# Altium schematic sheet UCC 28180-1-V02.SchDoc: Title is Here
size B; Author: Taisen Zhuang; Organization: Altium Limited; Address1: L3, 12a Rodborough Rd; Address2: Frenchs Forest; Address3: NSW; Address4: Australia 2086; DocumentNumber: FMC_Microzed; Revision: B; SheetNumber: 1; SheetTotal: 3
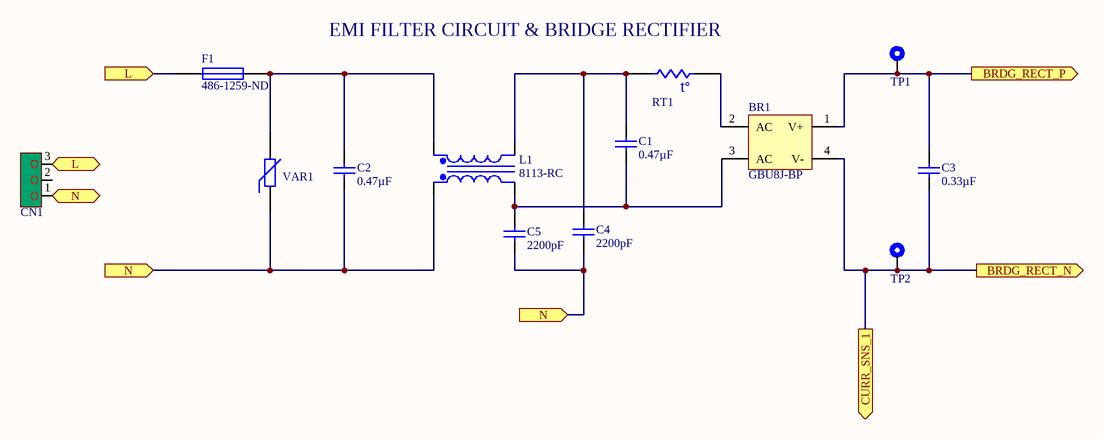
[diagram p0: UCC 28180-1-V02.SchDoc]

## Parts
BR1  GBU8J-BP  [GBU8J]
C1  Capacitance: 0.47µF  [ECQ-U2A474ML]  (hidden comment: ECQ-U2A474ML)
C2  Capacitance: 0.47µF  [ECQ-U2A474ML]  (hidden comment: ECQ-U2A474ML)
C3  Capacitance: 0.33µF  [CAPFILM0.33U]  (hidden comment: ECQ-U2A334ML)
C4  Capacitance: 2200pF  [CS11-E2GA222MYNS]  (hidden comment: CS11-E2GA222MYNS)
C5  Capacitance: 2200pF  [CS11-E2GA222MYNS]  (hidden comment: CS11-E2GA222MYNS)
CN1  1935789  [CONN_1935789]  (value not drawn)
F1  Supplier Part Number 1: 486-1259-ND  [0031.8211]  (hidden comment: FUSE)
L1  8113-RC  [EMI Choke]
RT1  CL-40  [CL-40]  (value not drawn)
TP1  5006  [Test Point]  (value not drawn)
TP2  5006  [Test Point]  (value not drawn)
VAR1  S10K275E2  [S10K275E2]  (value not drawn)

## Ports
BRDG_RECT_N (out), BRDG_RECT_P (out), CURR_SNS_1 (out), L (in), L (out), N (in), N (out)

## Nets
BRDG_RECT_N: BR1.4(V-) C3.1 TP2.1 ; port BRDG_RECT_N, port CURR_SNS_1
BRDG_RECT_P: BR1.1(V+) C3.2 TP1.1 ; port BRDG_RECT_P
L: CN1.3 F1.1 ; port L
N: C2.2 C4.1 C5.1 CN1.1 L1.1(Pri+) VAR1.1 ; port N
NetBR1_2: BR1.2(AC) RT1.1
NetBR1_3: BR1.3(AC) C1.1 C5.2 L1.2(Pri-)
NetC1_2: C1.2 C4.2 L1.3(Sec-) RT1.2
NetC2_1: C2.1 F1.2 L1.4(Sec+) VAR1.2

Not connected (* = marked no-connect by the designer): CN1 2

## Notes on the sheet
- (near RT1) EMI FILTER CIRCUIT & BRIDGE RECTIFIER
- PMLS Engineers R&D
- Title:
- Size:
- Date:
- B
- Document Number:
- Sheet:
- of
- Author:
- Rev:
- (in symbol CL-40) t°

## Library data of the parts
BR1 = GBU8J-BP: RECT BRIDGE GPP 8A 600V GBU; Manufacturer 1: Micro Commercial Co; Category 1: Discrete Semiconductor Products; Diode Type: Single Phase; Supplier 1: Digi-Key; Supplier Part Number 1: GBU8J-BPMS-ND; RoHS 1: RoHS Compliant; Description 1: RECT BRIDGE GPP 8A 600V GBU; Stock 1: 5723; Pricing 1: 1=0.98, 10=0.868, 25=0.784, 100=0.686, 250=0.602, 500=0.532, 1000=0.42, 2500=0.392, 5000=0.3724 (USD); Packaging: Tube; Part Status: Active; Voltage - Peak Reverse (Max): 600V; Current - DC Forward (If) (Max): 8A; Mounting Type: Through Hole; Package / Case: 4-SIP, GBU; Operating Temperature: -55°C ~ 150°C (TJ); Supplier Device Package: GBU; ComponentLink1URL: http://www.mccsemi.com/up_pdf/GBU8A-GBU8M(GBU).pdf; ComponentLink1Description: http://www.mccsemi.com/up_pdf/GBU8A-GBU8M(GBU).pdf; Manufacturer Part Number 1: GBU8J-BP
C1 C2 = ECQ-U2A474ML: CAP FILM 0.47UF 20% 275VAC RAD; Manufacturer 1: Panasonic Electronic Components; Category 1: Capacitors; Voltage Rating - AC: 275V; Dielectric Material: Polyester, Metallized; Supplier 1: Digi-Key; Supplier Part Number 1: P10734-ND; Manufacturer Part Number 1: ECQ-U2A474ML; RoHS 1: RoHS Compliant; Description 1: CAP FILM 0.47UF 20% 275VAC RAD; Stock 1: 12592; Pricing 1: 1=0.63, 10=0.464, 25=0.3976, 50=0.371, 100=0.318, 250=0.29152, 500=0.25176, 1000=0.212, 5000=0.1855 (USD); Packaging: Bulk; Part Status: Active; Tolerance: ±20%; Voltage Rating - DC: -; ESR (Equivalent Series Resistance): -; Operating Temperature: -40°C ~ 100°C; Mounting Type: Through Hole; Package / Case: Radial; Size / Dimension: 1.004" L x 0.335" W (25.50mm x 8.50mm); Height - Seated (Max): 0.709" (18.00mm); Termination: PC Pins; Lead Spacing: 0.886" (22.50mm); Applications: EMI, RFI Suppression; Features: X2 Safety Rated; ComponentLink1URL: http://industrial.panasonic.com/www-cgi/jvcr13pz.cgi?E+PZ+3+ABD0029+ECQU2A474ML+7+WW; ComponentLink1Description: http://industrial.panasonic.com/www-cgi/jvcr13pz.cgi?E+PZ+3+ABD0029+ECQU2A474ML+7+WW
C3 = ECQ-U2A334ML: CAP FILM 0.33UF 20% 275VAC RAD; Manufacturer 1: Panasonic Electronic Components; Category 1: Capacitors; Voltage Rating - AC: 275V; Dielectric Material: Polyester, Metallized; Supplier 1: Digi-Key; Supplier Part Number 1: P10733-ND; Manufacturer Part Number 1: ECQ-U2A334ML; RoHS 1: RoHS Compliant; Description 1: CAP FILM 0.33UF 20% 275VAC RAD; Stock 1: 584; Pricing 1: 1=0.6, 10=0.428, 25=0.3652, 50=0.3234, 100=0.2816, 250=0.23988, 500=0.2086, 1000=0.17731, 5000=0.15645 (USD); Packaging: Bulk; Part Status: Active; Tolerance: ±20%; Voltage Rating - DC: -; ESR (Equivalent Series Resistance): -; Operating Temperature: -40°C ~ 100°C; Mounting Type: Through Hole; Package / Case: Radial; Size / Dimension: 0.689" L x 0.374" W (17.50mm x 9.50mm); Height - Seated (Max): 0.709" (18.00mm); Termination: PC Pins; Lead Spacing: 0.591" (15.00mm); Applications: EMI, RFI Suppression; Features: X2 Safety Rated; ComponentLink1URL: http://industrial.panasonic.com/www-cgi/jvcr13pz.cgi?E+PZ+3+ABD0029+ECQU2A334ML+7+WW; ComponentLink1Description: http://industrial.panasonic.com/www-cgi/jvcr13pz.cgi?E+PZ+3+ABD0029+ECQU2A334ML+7+WW
C4 C5 = CS11-E2GA222MYNS: CAP CER 2200PF 250VAC RADIAL; Manufacturer 1: TDK Corporation; Category 1: Capacitors; Tolerance: ±20%; Temperature Coefficient: E; Ratings: X1, Y2; Supplier 1: Digi-Key; Supplier Part Number 1: 445-2424-ND; Manufacturer Part Number 1: CS11-E2GA222MYNS; RoHS 1: RoHS Compliant; Description 1: CAP CER 2200PF 250VAC RADIAL; Stock 1: 67; Pricing 1: 1=0.5, 10=0.349, 100=0.2093, 250=0.17436, 500=0.15694, 1000=0.13253, 5000=0.11858, 10000=0.1116, 25000=0.10463 (USD); Packaging: Bulk; Part Status: Obsolete; Voltage - Rated: 250VAC; Operating Temperature: -25°C ~ 105°C; Features: High Voltage; Applications: Safety; Failure Rate: -; Mounting Type: Through Hole; Package / Case: Radial, Disc; Size / Dimension: 0.413" Dia (10.50mm); Height - Seated (Max): 0.571" (14.50mm); Thickness (Max): -; Lead Spacing: 0.295" (7.50mm); Lead Style: Straight; ComponentLink1URL: http://media.digikey.com/pdf/Data%20Sheets/TDK%20PDFs/CS_Series.pdf; ComponentLink1Description: http://media.digikey.com/pdf/Data%20Sheets/TDK%20PDFs/CS_Series.pdf
CN1 = 1935789: CONN TERM BLOCK 3POS 5.0MM; Manufacturer 1: Phoenix Contact; Category 1: Connectors, Interconnects; Number of Levels: 1; Positions Per Level: 3; Pitch: 0.197" (5.00mm); Mating Orientation: Horizontal with Board; Current: 20A; Voltage: 300V; Wire Gauge: 12-20 AWG; Wire Termination: Screw; Torque - Screw: 0.45-0.5 Nm (3.9-4.4 Lb-In); Screw Thread: M3; Supplier 1: Digi-Key; Supplier Part Number 1: 277-6072-ND; Manufacturer Part Number 1: 1935789; RoHS 1: RoHS Compliant; Description 1: CONN TERM BLOCK 3POS 5.0MM; Stock 1: 4677; Pricing 1: 1=0.66, 10=0.633, 50=0.605, 100=0.5885, 250=0.55, 500=0.506, 1000=0.4675 (USD); Packaging: Bulk; Part Status: Active; Mounting Type: Through Hole; Features: Interlocking (Side); Color: Green; Operating Temperature: -; Housing Material: Polyamide (PA), Nylon; Contact Material - Plating: -; Clamp Material - Plating: -; Screw Material - Plating: -; ComponentLink1URL: http://media.digikey.com/pdf/Data%20Sheets/Phoenix%20Contact%20PDFs/COMBICON%20Compact%20PT2,5.pdf; ComponentLink1Description: http://media.digikey.com/pdf/Data%20Sheets/Phoenix%20Contact%20PDFs/COMBICON%20Compact%20PT2,5.pdf
F1 = FUSE: Manufacturer: Schurter Inc.; Fuseholder Type: Block; Fuse Type: Cartridge; For Use With/Related Products: 5mm x 20mm; Number of Circuits: 1; Voltage: 500V; Current Rating: 10A; Supplier 1: Digi-Key; Manufacturer Part Number: 0031.8211; RoHS: RoHS Compliant; Category: Circuit Protection; Stock 1: 17476; Pricing 1: 1=0.69, 50=0.4932, 100=0.4658, 250=0.4384, 500=0.411, 1000=0.3836, 5000=0.36442 (USD); Part Status: Active; Fuse Size: 5mm x 20mm; Mounting Type: PCB; Orientation: Horizontal; Termination Style: PC Pin; Contact Material: Copper Alloy; Contact Finish: Tin; ComponentLink1URL: http://www.schurterinc.com/bundles/snceschurter/epim/_ProdPool_/newDS/en/typ_OGN.pdf; ComponentLink1Description: http://www.schurterinc.com/bundles/snceschurter/epim/_ProdPool_/newDS/en/typ_OGN.pdf
L1 = 8113-RC: CMC 5MH 8.9A 2LN TH; Manufacturer 1: Bourns Inc.; Category 1: Filters; Number of Lines: 2; Inductance @ Frequency: 5mH @ 1kHz; DC Resistance (DCR) (Max): 22 mOhm; Supplier 1: Digi-Key; Supplier Part Number 1: M8908-ND; RoHS 1: RoHS Compliant; Description 1: CMC 5MH 8.9A 2LN TH; Stock 1: 1449; Pricing 1: 1=7.52, 10=6.688, 25=6.1864, 50=5.5594 (USD); Packaging: Tray; Part Status: Active; Filter Type: -; Impedance @ Frequency: -; Current Rating (Max): 8.9A; Voltage Rating - DC: -; Voltage Rating - AC: -; Operating Temperature: -55°C ~ 105°C; Ratings: -; Approvals: -; Features: -; Mounting Type: Through Hole; Size / Dimension: 1.450" L x 0.800" W (36.83mm x 20.32mm); Height (Max): 1.500" (38.10mm); Package / Case: Vertical, 4 PC Pin; ComponentLink1URL: http://www.bourns.com/docs/Product-Datasheets/8100_series.pdf; ComponentLink1Description: http://www.bourns.com/docs/Product-Datasheets/8100_series.pdf; Manufacturer Part Number 1: 8113-RC
RT1 = CL-40: ICL 5 OHM 25% 6A 19.56MM; Manufacturer 1: Amphenol Advanced Sensors; Category 1: Circuit Protection; R @ 25°C: 5 Ohm; R @ Current: 0.11 Ohm; Approvals: UL; Supplier 1: Digi-Key; Supplier Part Number 1: KC004L-ND; Manufacturer Part Number 1: CL-40; RoHS 1: RoHS Compliant; Description 1: ICL 5 OHM 25% 6A 19.56MM; Stock 1: 7009; Pricing 1: 1=1.56, 5=1.512, 10=1.415, 25=1.3664, 50=1.1712, 100=0.976, 250=0.9516, 500=0.8052, 1000=0.7076 (USD); Packaging: Bulk; Part Status: Active; Tolerance: ±25%; Current - Steady State Max: 6A; Diameter: 0.77" (19.56mm); Lead Spacing: 0.328" (8.33mm); ComponentLink1URL: http://www.amphenol-sensors.com/index.php?option=com_edocman&task=document.download&id=90; ComponentLink1Description: http://www.amphenol-sensors.com/index.php?option=com_edocman&task=document.download&id=90
TP1 TP2 = 5006: TEST POINT PC COMPACT .063"D BLK; Manufacturer 1: Keystone Electronics; Category 1: Test and Measurement; Plating: Silver; Material - Insulation: Nylon 46, UL 94V-0; Material - Body: Phosphor Bronze; Supplier 1: Digi-Key; Supplier Part Number 1: 36-5006-ND; Manufacturer Part Number 1: 5006; RoHS 1: RoHS Compliant; Description 1: TEST POINT PC COMPACT .063"D BLK; Stock 1: 199444; Pricing 1: 1=0.37, 10=0.316, 50=0.2298, 100=0.2209, 250=0.19832, 500=0.18932, 1000=0.1616, 2500=0.14424, 5000=0.13523 (USD); Packaging: Bulk; Part Status: Active; Type: PC Test Point, Compact; Mounting Type: 0.063" (1.60mm) Hole Diameter; Color: Black; Size / Dimension: 0.125" Dia x 0.220" L (3.18mm x 5.59mm); ComponentLink1URL: http://www.keyelco.com/product-pdf.cfm?p=1314; ComponentLink1Description: http://www.keyelco.com/product-pdf.cfm?p=1314
VAR1 = S10K275E2: VARISTOR 430V 3.5KA DISC 10MM; Manufacturer 1: EPCOS (TDK); Category 1: Circuit Protection; Varistor Voltage (Min): 387V; Varistor Voltage (Max): 473V; Energy: 55J; Number of Circuits: 1; Maximum AC Volts: 275VAC; Maximum DC Volts: 350VDC; Supplier 1: Digi-Key; Supplier Part Number 1: 495-1433-ND; RoHS 1: RoHS Compliant; Description 1: VARISTOR 430V 3.5KA DISC 10MM; Stock 1: 24715; Pricing 1: 1=0.48, 10=0.4, 100=0.3003, 500=0.22022, 1000=0.17017, 5000=0.14515, 10000=0.13514 (USD); Packaging: Bulk; Part Status: Active; Varistor Voltage (Typ): 430V; Current - Surge: 3.5kA; Mounting Type: Through Hole; Package / Case: Disc 10mm; ComponentLink1URL: http://en.tdk.eu/inf/70/db/var_11/SIOV_Leaded_AdvanceD.pdf; ComponentLink1Description: http://en.tdk.eu/inf/70/db/var_11/SIOV_Leaded_AdvanceD.pdf; Manufacturer Part Number 1: S10K275E2